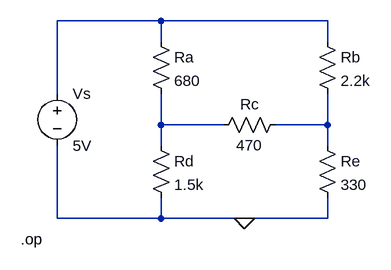
[diagram p0: schematic Esquematico_C.asc]
Esquematico_C.asc, the LTspice schematic file:
Version 4.1
SHEET 1 880 680
WIRE 192 16 32 16
WIRE 448 16 192 16
WIRE 192 48 192 16
WIRE 448 48 448 16
WIRE 32 128 32 16
WIRE 192 176 192 128
WIRE 288 176 192 176
WIRE 448 176 448 128
WIRE 448 176 368 176
WIRE 192 208 192 176
WIRE 448 208 448 176
WIRE 32 320 32 208
WIRE 192 320 192 288
WIRE 192 320 32 320
WIRE 320 320 192 320
WIRE 448 320 448 288
WIRE 448 320 320 320
FLAG 320 320 0
SYMBOL voltage 32 112 R0
WINDOW 123 0 0 Left 0
WINDOW 39 0 0 Left 0
SYMATTR InstName Vs
SYMATTR Value 5V
SYMBOL res 176 32 R0
SYMATTR InstName Ra
SYMATTR Value 680
SYMBOL res 176 192 R0
SYMATTR InstName Rd
SYMATTR Value 1.5k
SYMBOL res 384 160 R90
WINDOW 0 0 56 VBottom 2
WINDOW 3 32 56 VTop 2
SYMATTR InstName Rc
SYMATTR Value 470
SYMBOL res 432 192 R0
SYMATTR InstName Re
SYMATTR Value 330
SYMBOL res 432 32 R0
SYMATTR InstName Rb
SYMATTR Value 2.2k
TEXT -24 352 Left 2 !.op

The netlist it stands for:
* Esquematico_C.asc
Vs N001 0 5V
Ra N001 N002 680
Rd N002 0 1.5k
Rc N003 N002 470
Re N003 0 330
Rb N001 N003 2.2k
.op
.backanno
.end